# EasyEDA schematic 1-Schematic_CessnaCitationX_APU.json
TITLE: APU Board; REV: 1.0; Date: 2019-01-11; Sheet: 1/1; Drawn By: F-ORKI
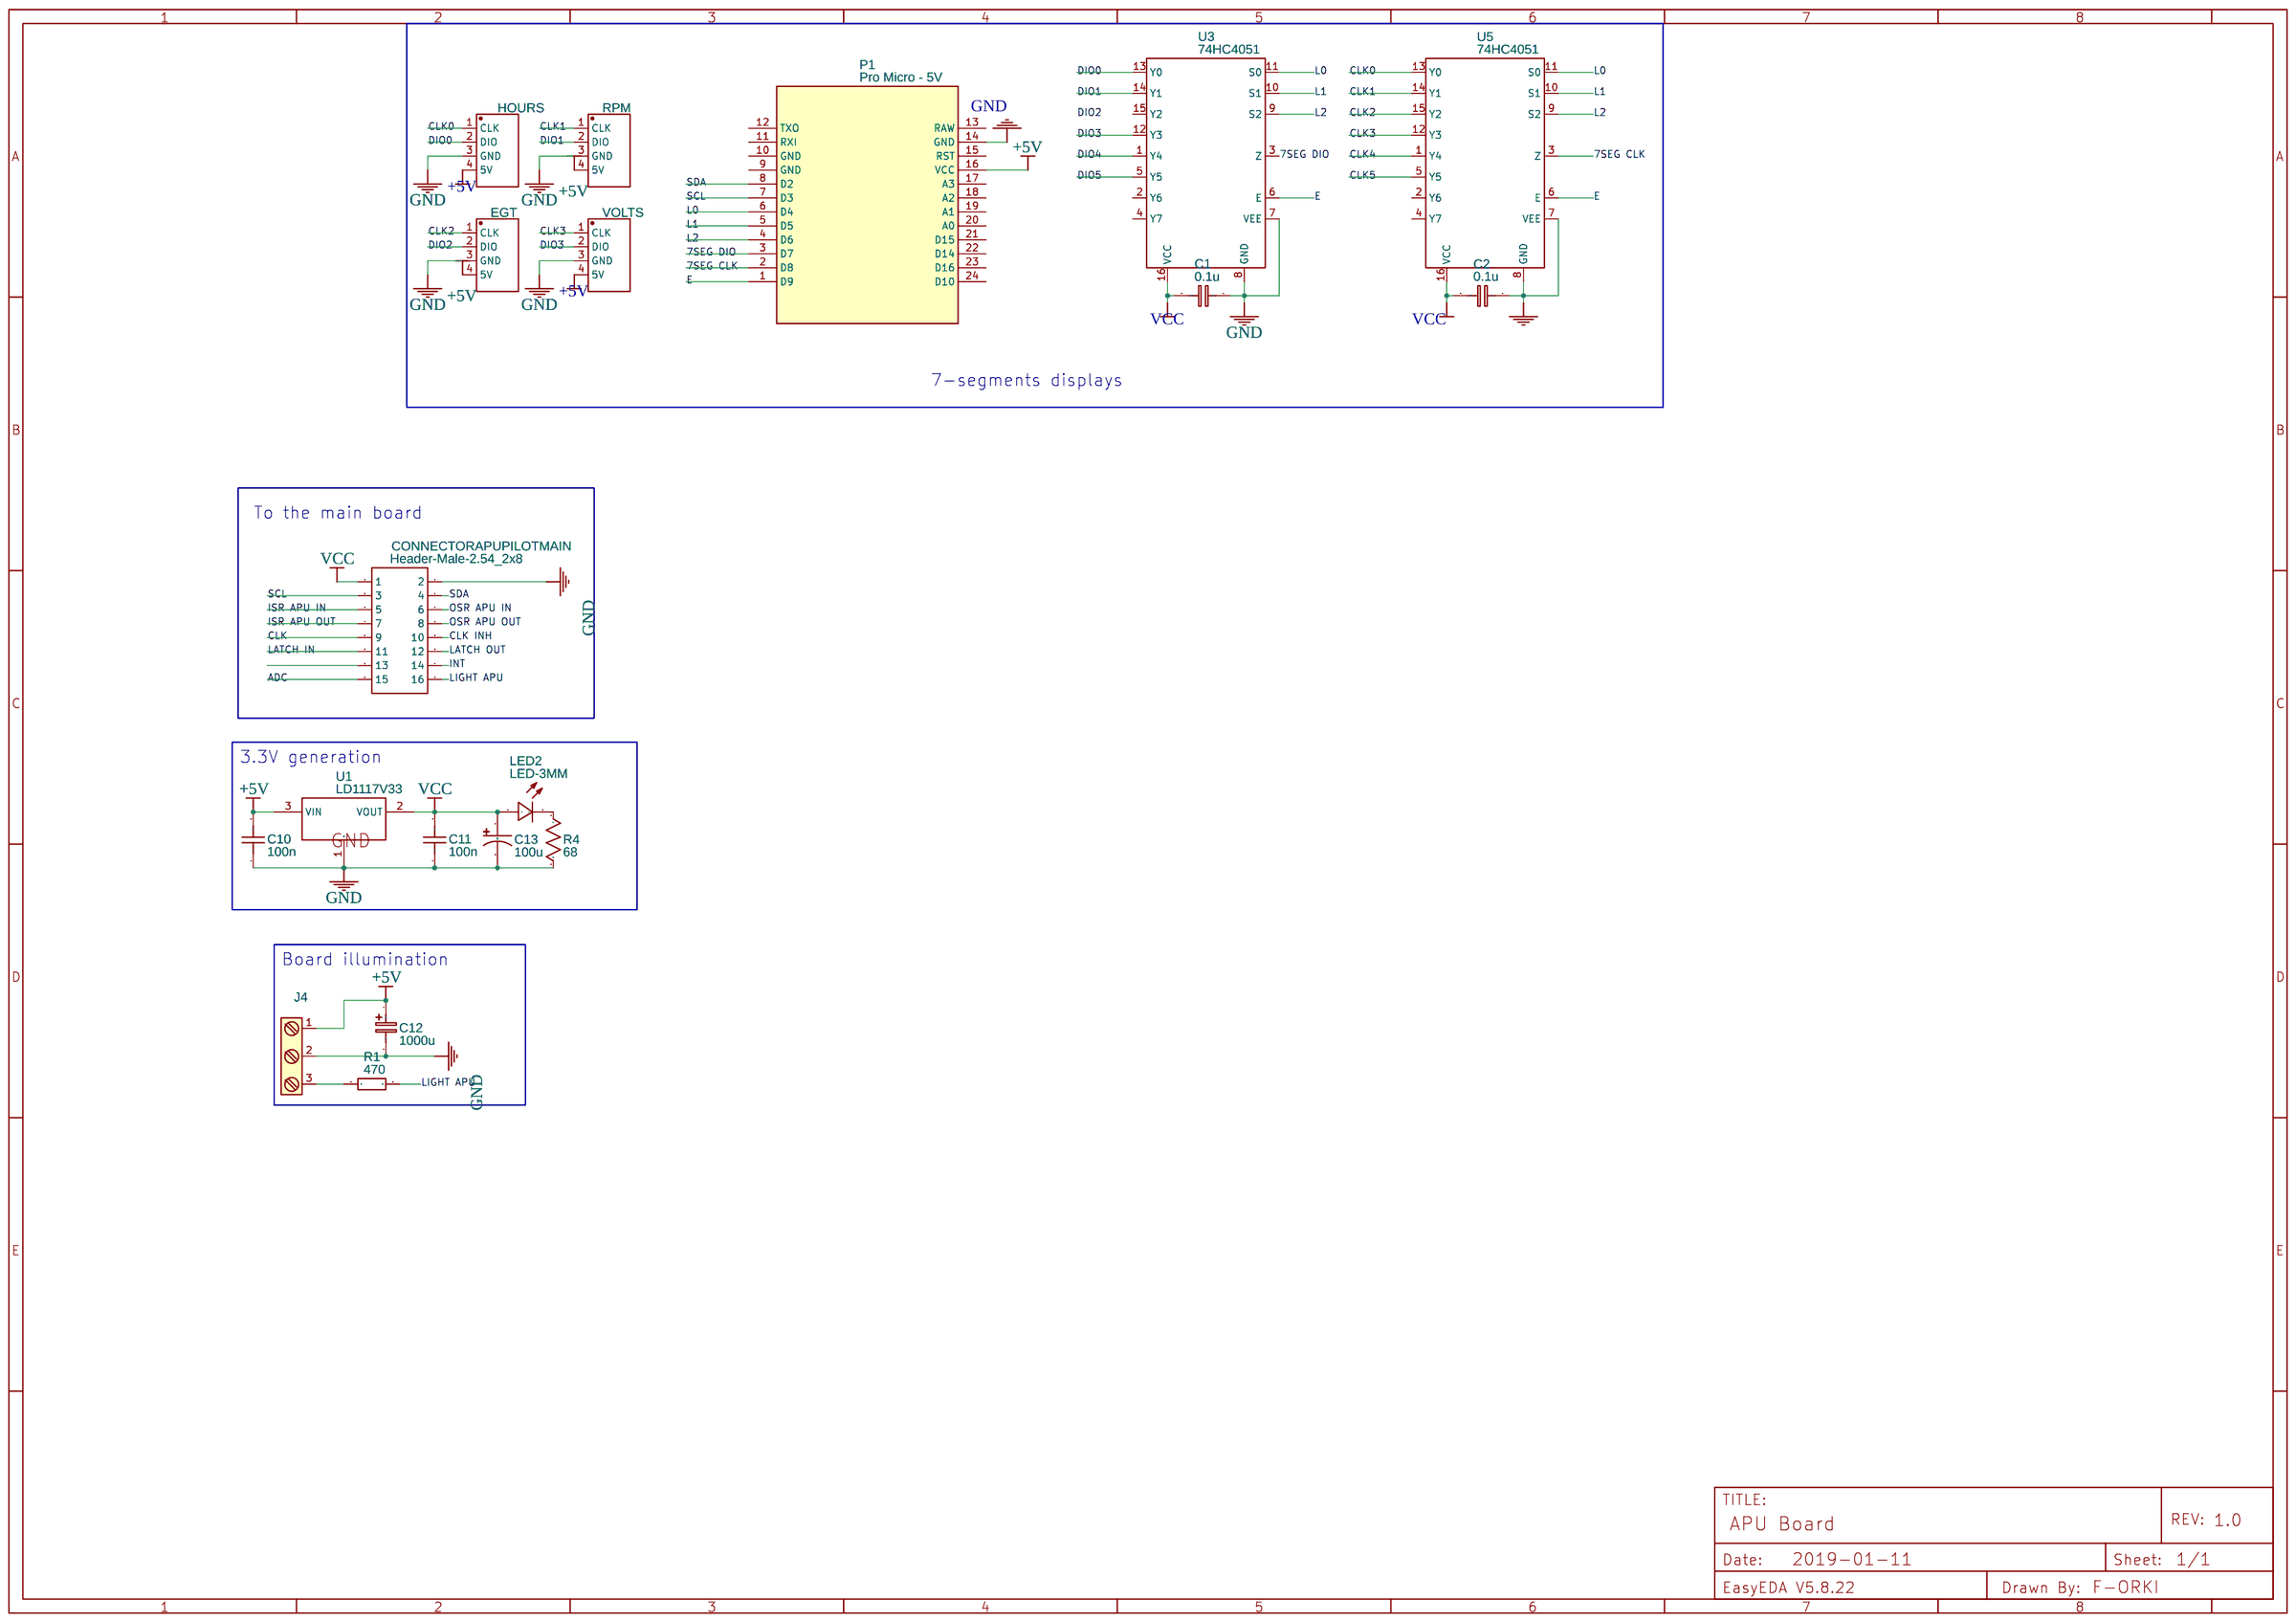
[diagram p0: schematic sheet]

## Parts
C1  0.1u  [RAD-0.1]
C2  0.1u  [RAD-0.1]
C10  100n  [RAD-0.1]
C11  100n  [RAD-0.1]
C12  1000u  [CAP-D3.0XF1.5]
C13  100u  [CAP-D3.0XF1.5]
CONNECTORAPUPILOTMAIN  Header-Male-2.54_2x8  [HDR-8X2/2.54]
EGT  7seg display module TM1637  [WJ2EDGVC-5.08-4P]
HOURS  7seg display module TM1637  [WJ2EDGVC-5.08-4P]
J4  Screw_Terminal_1x03  [SIP-3-2.54MM]
LED2  LED-3MM  [LED-3MM/2.54]
P1  Pro Micro - 5V  [PRO MICRO - 5V]
R1  470  [AXIAL-0.3]
R4  68  [AXIAL-0.3]
RPM  7seg display module TM1637  [WJ2EDGVC-5.08-4P]
U1  LD1117V33  [TO-220(TO-220-3)]
U3  74HC4051  [DIL16-O]
U5  74HC4051  [DIL16-O]
VOLTS  7seg display module TM1637  [WJ2EDGVC-5.08-4P]

## Library data of the parts
C1 C2 = Cap_RAD-0.1_EU: Manufacturer Part: ?
C10 C11 = Cap_RAD-0.1_US: Manufacturer Part: ?
C12 = Cap_Electrolytic(TH)_D3.0XF1.5_EU: Contributor: EasyEDA; Manufacturer Part: ?
C13 = Cap_Electrolytic(TH)_D3.0XF1.5_US: Manufacturer Part: ?
CONNECTORAPUPILOTMAIN = -: Supplier Part: C68234; Supplier: LCSC; Manufacturer: BOOMELE; Manufacturer Part: Double row straight 2*8Headers  Pins 2.54mm; image: //image.lceda.cn/szlcsc/C68234.jpg
EGT HOURS RPM VOLTS = -: Supplier: LCSC; Manufacturer: ReliaPro; image: //image.lceda.cn/szlcsc/C8471.jpg; Supplier Part: C8471
J4 = -: Contributor: KiCAD; license: https://www.gnu.org/licenses/lgpl-2.1.html; Manufacturer Part: ?
LED2 = -: Supplier: LCSC; Manufacturer: EVERLIGHT; Manufacturer Part: 204-10SURD/S530-A3; Supplier Part: C99772
P1 = -: sourceId: 1T5FDZYC8; Manufacturer Part: ?
R1 = Res_AXIAL-0.3(1/8W)_EU: Manufacturer Part: ?
R4 = Res_AXIAL-0.3(1/8W)_US: Manufacturer Part: ?
U1 = -: Supplier: LCSC; Supplier Part: C283467; Manufacturer: STMicroelectronics; Contributor: LCSC
U3 U5 = -: Contributor: Ftec; Manufacturer Part: ?

## Nets
+5V: C10.2 C12.1 EGT.4(5V) HOURS.4(5V) J4.1 P1.16(VCC) RPM.4(5V) U1.3(VIN) VOLTS.4(5V)
GND: C1.1 C2.1 C10.1 C11.1 C12.2 C13.2 CONNECTORAPUPILOTMAIN.2 EGT.3(GND) HOURS.3(GND) J4.2 P1.14(GND) R4.2 RPM.3(GND) U1.1(GND) U3.7(VEE) U3.8(GND) U5.7(VEE) U5.8(GND) VOLTS.3(GND)
VCC: C1.2 C2.2 C11.2 C13.1 CONNECTORAPUPILOTMAIN.1 LED2.1(+) U1.2(VOUT) U3.16(VCC) U5.16(VCC)
7SEG CLK: P1.2(D8) U5.3(Z)
7SEG DIO: P1.3(D7) U3.3(Z)
ADC: CONNECTORAPUPILOTMAIN.15
CLK: CONNECTORAPUPILOTMAIN.9
CLK0: HOURS.1(CLK) U5.13(Y0)
CLK1: RPM.1(CLK) U5.14(Y1)
CLK2: EGT.1(CLK) U5.15(Y2)
CLK3: U5.12(Y3) VOLTS.1(CLK)
CLK4: U5.1(Y4)
CLK5: U5.5(Y5)
CLK INH: CONNECTORAPUPILOTMAIN.10
DIO0: HOURS.2(DIO) U3.13(Y0)
DIO1: RPM.2(DIO) U3.14(Y1)
DIO2: EGT.2(DIO)
DIO3: U3.12(Y3) VOLTS.2(DIO)
DIO4: U3.1(Y4)
DIO5: U3.5(Y5)
E: P1.1(D9) U3.6(E) U5.6(E)
INT: CONNECTORAPUPILOTMAIN.14
ISR APU IN: CONNECTORAPUPILOTMAIN.5
ISR APU OUT: CONNECTORAPUPILOTMAIN.7
L0: P1.6(D4) U3.11(S0) U5.11(S0)
L1: P1.5(D5) U3.10(S1) U5.10(S1)
L2: P1.4(D6) U3.9(S2) U5.9(S2)
LATCH IN: CONNECTORAPUPILOTMAIN.11
LATCH OUT: CONNECTORAPUPILOTMAIN.12
LIGHT APU: CONNECTORAPUPILOTMAIN.16 R1.2
OSR APU IN: CONNECTORAPUPILOTMAIN.6
OSR APU OUT: CONNECTORAPUPILOTMAIN.8
SCL: CONNECTORAPUPILOTMAIN.3 P1.7(D3)
SDA: CONNECTORAPUPILOTMAIN.4 P1.8(D2)
Net-(J4-3): J4.3 R1.1
Net-(LED2-2): LED2.2(-) R4.1

Not connected (* = marked no-connect by the designer): CONNECTORAPUPILOTMAIN 13; P1 9(GND) 10(GND) 11(RXI) 12(TXO) 13(RAW) 15(RST) 17(A3) 18(A2) 19(A1) 20(A0) 21(D15) 22(D14) 23(D16) 24(D10); U3 2(Y6) 4(Y7) 15(Y2); U5 2(Y6) 4(Y7)

## Notes on the sheet
- 7-segments displays
- To the main board
- 3.3V generation
- Board illumination
